# Altium schematic sheet USB2CAN.SchDoc
size A4; SheetNumber: 3; SheetTotal: 4; SPICEModelCacheDJWCCONK: <root> / <DocumentId>DJWCCONK</DocumentId> / <CacheFrame Number="0"> / <Model Name="0603_150060vs55040" Kind="CKT"> / <Text>***************************** / .subckt 0603_150060VS55040 1 2 / D1 1 2 SMCD / .MODEL SMCD D / + IS=135.21E-15 / + N=2.0992 / + RS=1.0413 / + IKF=173.47E-9 / + CJO=1.0000E-12 / + M=.3333 / + VJ=.75 / + BV=5 / + IBV=100.00E-6 / + TT=5.0000E-9 / .ends</Text> / </Model> / </CacheFrame> / </root>
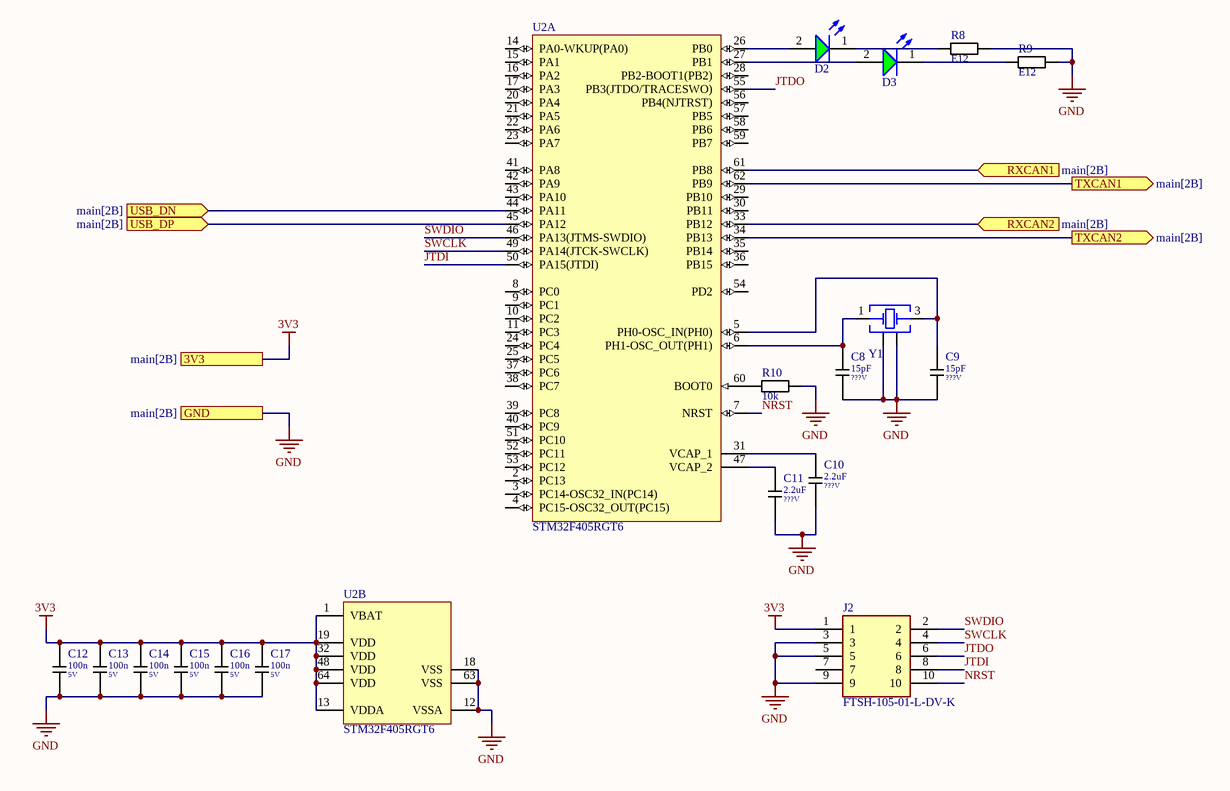
[diagram p0: USB2CAN.SchDoc]

## Parts
C8  value 15pF  Spg: ???V  [0603_C]  (hidden comment: 15pF_???V)
C9  value 15pF  Spg: ???V  [0603_C]  (hidden comment: 15pF_???V)
C10  value 2.2uF  Spg: ???V  [0603_C]  (hidden comment: 2.2uF_???V)
C11  value 2.2uF  Spg: ???V  [0603_C]  (hidden comment: 2.2uF_???V)
C12  value 100n  Spg: 5V  [0603_C]  (hidden comment: 100n_5V)
C13  value 100n  Spg: 5V  [0603_C]  (hidden comment: 100n_5V)
C14  value 100n  Spg: 5V  [0603_C]  (hidden comment: 100n_5V)
C15  value 100n  Spg: 5V  [0603_C]  (hidden comment: 100n_5V)
C16  value 100n  Spg: 5V  [0603_C]  (hidden comment: 100n_5V)
C17  value 100n  Spg: 5V  [0603_C]  (hidden comment: 100n_5V)
D2  Bright Green, 2V, 140°  [WL-SMCD_0603]  (value not drawn)
D3  Bright Green, 2V, 140°  [WL-SMCD_0603]  (value not drawn)
J2  FTSH-105-01-L-DV-K  [FTSH10501LDVK]
R8  E12  [0603_R]
R9  E12  [0603_R]
R10  10k  [0603_R]
U2  STM32F405RGT6  [STM-LQFP64_N]  (parts A,B of 2)
Y1  8MHz  [WE-XTAL_CFPX-180]  (value not drawn)

## Ports
3V3 (see main[2B]), GND (see main[2B]), RXCAN1 (in, see main[2B]), RXCAN2 (in, see main[2B]), TXCAN1 (out, see main[2B]), TXCAN2 (out, see main[2B]), USB_DN (in, see main[2B]), USB_DP (in, see main[2B])

## Nets
3V3: C12.1 C13.1 C14.1 C15.1 C16.1 C17.1 J2.1 U2.1(VBAT) U2.13(VDDA) U2.19(VDD) U2.32(VDD) U2.48(VDD) U2.64(VDD) ; port 3V3
GND: C8.2 C9.2 C10.2 C11.2 C12.2 C13.2 C14.2 C15.2 C16.2 C17.2 J2.3 J2.5 J2.9 R8.2 R9.2 R10.2 U2.12(VSSA) U2.18(VSS) U2.63(VSS) Y1.2(GND&Lid) Y1.4(GND&Lid) ; port GND
JTDI: J2.8 U2.50(PA15(JTDI))
JTDO: J2.6 U2.55(PB3(JTDO/TRACESWO))
NRST: J2.10 U2.7(NRST)
RXCAN1: U2.61(PB8) ; port RXCAN1
RXCAN2: U2.33(PB12) ; port RXCAN2
SWCLK: J2.4 U2.49(PA14(JTCK-SWCLK))
SWDIO: J2.2 U2.46(PA13(JTMS-SWDIO))
TXCAN1: U2.62(PB9) ; port TXCAN1
TXCAN2: U2.34(PB13) ; port TXCAN2
USB_DN: U2.44(PA11) ; port USB_DN
USB_DP: U2.45(PA12) ; port USB_DP
NetC8_1: C8.1 U2.6(PH1-OSC_OUT(PH1)) Y1.1(Crystal)
NetC9_1: C9.1 U2.5(PH0-OSC_IN(PH0)) Y1.3(Crystal)
NetC10_1: C10.1 U2.31(VCAP_1)
NetC11_1: C11.1 U2.47(VCAP_2)
NetD2_1: D2.1(K) R8.1
NetD2_2: D2.2(A) U2.26(PB0)
NetD3_1: D3.1(K) R9.1
NetD3_2: D3.2(A) U2.27(PB1)
NetR10_1: R10.1 U2.60(BOOT0)

Not connected (* = marked no-connect by the designer): J2 7; U2 2(PC13) 3(PC14-OSC32_IN(PC14)) 4(PC15-OSC32_OUT(PC15)) 8(PC0) 9(PC1) 10(PC2) 11(PC3) 14(PA0-WKUP(PA0)) 15(PA1) 16(PA2) 17(PA3) 20(PA4) 21(PA5) 22(PA6) 23(PA7) 24(PC4) 25(PC5) 28(PB2-BOOT1(PB2)) 29(PB10) 30(PB11) 35(PB14) 36(PB15) 37(PC6) 38(PC7) 39(PC8) 40(PC9) 41(PA8) 42(PA9) 43(PA10) 51(PC10) 52(PC11) 53(PC12) 54(PD2) 56(PB4(NJTRST)) 57(PB5) 58(PB6) 59(PB7)

## Library data of the parts
C8-C17 = C_0603_Keramik: Keramikkondensatoren 0603; EBS_Nummer: %%%; HelpURL: %%%
D2 D3 = 150060VS55040: WL-SMCD Mono-color Chip LED Diffused, SMT, size 0603, Bright Green, 2V, 140°; Manufacturer: Wurth Elektronik; Case/Size Code: 0603; Chip Technology: AlInGaP; Dominant Wavelength: 573nm; Luminous Intensity: 60mcd; Peak Wavelength: 575nm; Manufacturer Part Number: 150060VS55040; Category: Signal LEDs; Match Code: WL-SMCD; ComponentLink1Description: Website Link; ComponentLink1URL: https://www.we-online.com/redexpert/article/150060VS55040?ad; ComponentLink2Description: Datasheet Link; ComponentLink2URL: https://www.we-online.com/redexpert/spec/150060VS55040?ad; Mount: Surface Mount; Operating Temperature Max: 85°C; Operating Temperature Min: -40°C; Packaging: Tape and Reel; Length: 1.6mm; Width: 0.8mm; Height: 0.4mm; Emitting Color: Bright Green; Forward Voltage: 2V; Viewing Angle: 140°
J2 = FTSH-105-01-L-DV-K: Samtec, FTSH, 10 Way, 2 Row, Straight Pin Header; Geometry.Height: 6.1mm; Mouser Part Number: 200-FTSH10501LDVK; Mouser Price/Stock: https://www.mouser.co.uk/ProductDetail/Samtec/FTSH-105-01-L-DV-K?qs=%252B5JSS813miOqo3Vy%252BvhCFg%3D%3D; Manufacturer_Name: SAMTEC; Manufacturer_Part_Number: FTSH-105-01-L-DV-K; Datasheet Link: https://www.arrow.com/en/products/ftsh-105-01-l-dv-k/samtec
R8-R10 = R_0603: R 0603, 75V, 0.1W; EBS_Nummer: %%%; HelpURL: %%%
  R8 R9: Value: E12
  R10: Value: 10k
U2 = STM32F405RGT6: ARM Cortex-M4 32-bit MCU+FPU, 210 DMIPS, 1024 kB Flash, 192 kB Internal RAM, 51 I/Os, 64-pin LQFP, -40 to 85 degC, Tray; Manufacturer: STMicroelectronics; D/A Converter: 2x12-bit; FLASH Size (Prog) (kB): 1024; I/Os (High Current): 51; Internal RAM Size (kB): 192; Operating Frequency(F) (Processor speed) (MHz): 168; Supply Voltage(Vcc) max (V): 3.6; Supply Voltage(Vcc) min (V): 1.8; DatasheetVersion: Rev. 4; PackageVersion: Rev. 4, 06/2013; PackageReference: LQFP64; PackageDescription: 64-Pin Low Profile Quad Flat Package, 10 x 10 mm Body, 0.5 mm Pitch; Supplier 1: Digi-Key; Supplier Part Number 1: 497-11767-ND; Supplier 2: Farnell; Supplier Part Number 2: 2064363; Supplier 3: Newark; Supplier Part Number 3: 73T2329; Supplier 4: Mouser; Supplier Part Number 4: 511-STM32F405RGT6; Core: ARM Cortex-M4; Packing: Tray; Mounting Technology: Surface Mount; PartNumber: STM32F405RGT6; ComponentLink1Description: Manufacturer URL; ComponentLink1URL: http://www.st.com/web/en/home.html; ComponentLink2Description: Datasheet; ComponentLink2URL: http://www.st.com/st-web-ui/static/active/en/resource/technical/document/datasheet/DM00037051.pdf; ComponentLink3Description: Package Specification; ComponentLink3URL: http://www.st.com/st-web-ui/static/active/en/resource/technical/document/datasheet/DM00037051.pdf
Y1 = 830108313809: WE-XTAL Quartz Crystal, SMT, CFPX-180, 8MHz, +/-30ppm; Manufacturer: Wurth Elektronik; Frequency Stability: +/-50ppm; Load Capacitance: 12pF; ComponentLink1Description: Website Link; ComponentLink1URL: https://www.we-online.com/redexpert/article/830108313809?ad; ComponentLink2Description: Datasheet Link; ComponentLink2URL: https://www.we-online.com/redexpert/spec/830108313809?ad; Manufacturer Part Number: 830108313809; Category: Crystals; Match Code: WE-XTAL; Mount: Surface Mount; Operating Temperature Max: 85°C; Operating Temperature Min: -40°C; Packaging: Tape and Reel; Case/Size Code: CFPX-180; Length: 3.4mm; Width: 2.7mm; Height: 0.8mm; Frequency: 8MHz; Frequency Tolerance: +/-30ppm